# EAGLE schematic StripController1 (EAGLE 6.4)
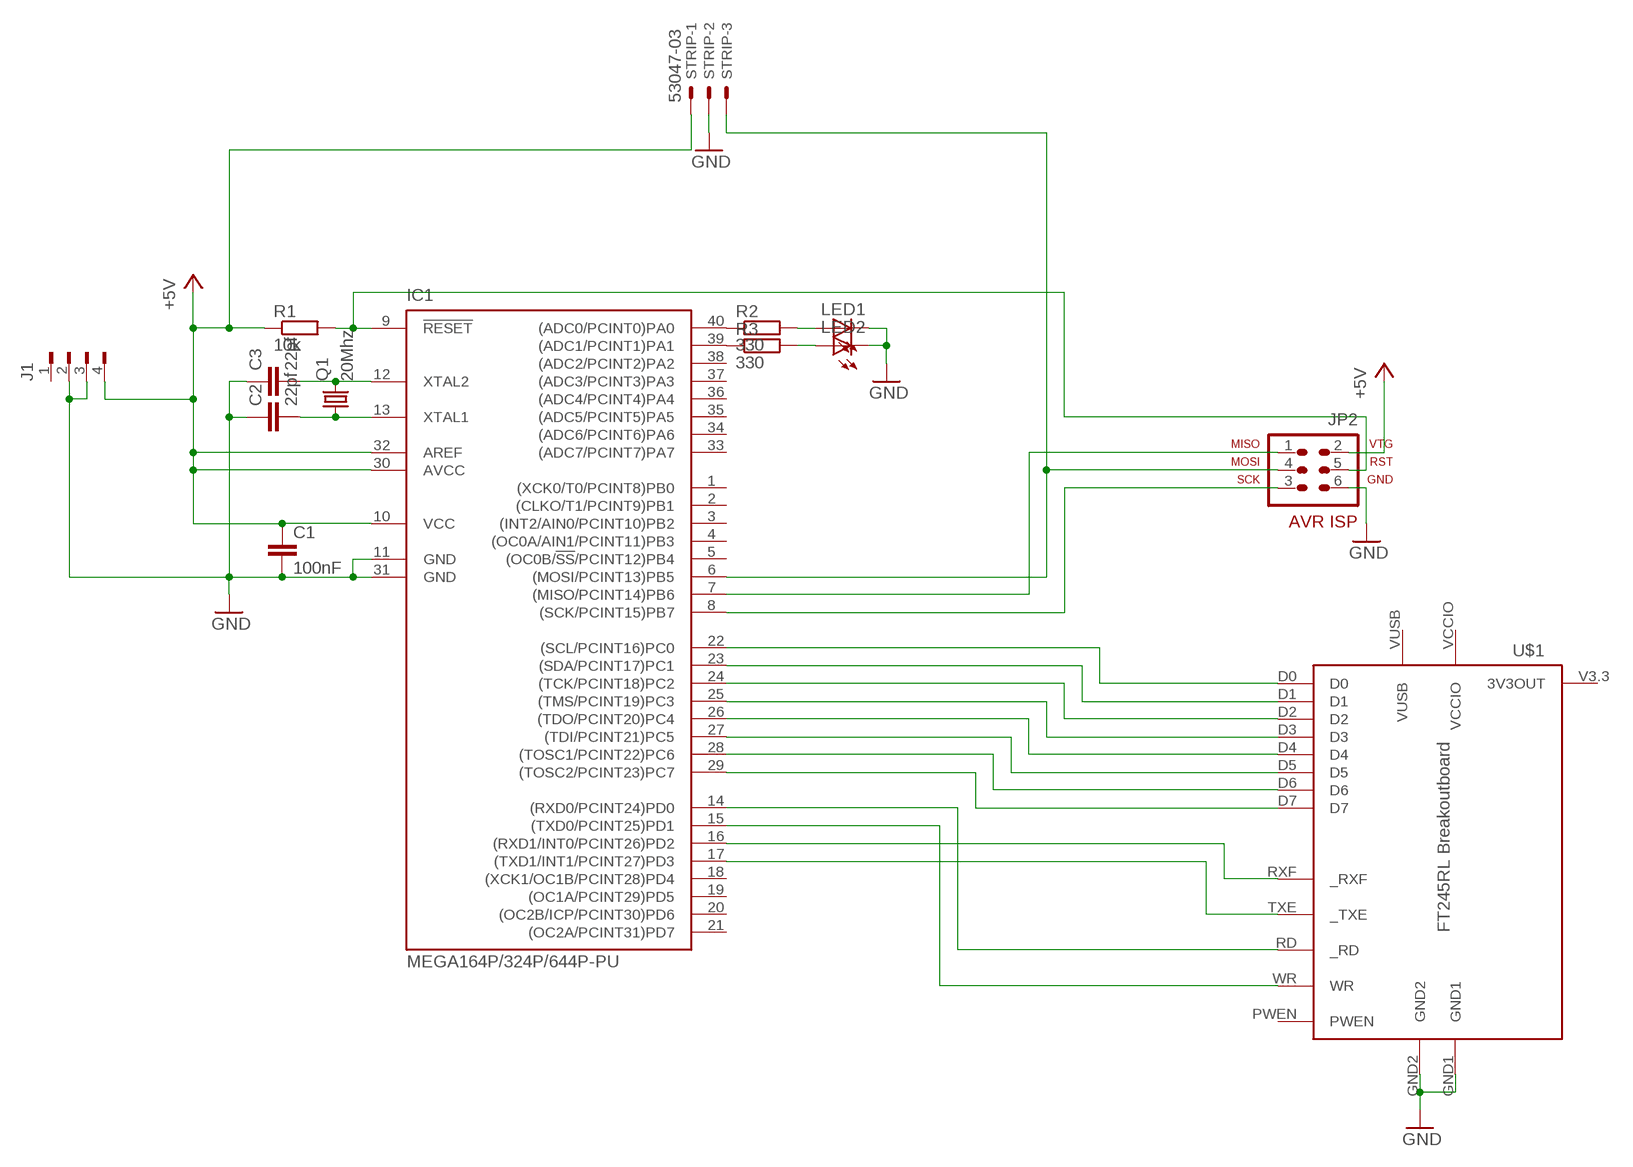
[diagram p0: schematic, sheet 1]

## Parts
C1  100nF  C-EU050-030X075  [C050-030X075]
C2  22pf  C-EU050-024X044  [C050-024X044]
C3  22pf  C-EU050-024X044  [C050-024X044]
IC1  MEGA164P/324P/644P-PU  [DIL40]
J1  FLOPPY-4  [FLOPPY-4]
JP2  AVR-ISP-6  [AVR-ISP-6]
LED1  LED3MM  [LED3MM]
LED2  LED3MM  [LED3MM]
Q1  20Mhz  CRYSTALHC49U70  [HC49U70]
R1  10k  R-EU_0207/10  [0207/10]
R2  330  R-EU_0207/10  [0207/10]
R3  330  R-EU_0207/10  [0207/10]
STRIP  53047-03  [53047-03]
U$1  FT245RL_BREAKOUTBOARD  [SPARKFUN_FT245RL_BOARD]

## Nets
+5V: C1.1 IC1.10(VCC) IC1.30(AVCC) IC1.32(AREF) J1.4 JP2.2 R1.1 STRIP.1
GND: C1.2 C2.1 C3.1 IC1.11(GND) IC1.31(GND) J1.2 J1.3 JP2.6 LED1.K(C) LED2.K(C) STRIP.2 U$1.GND1 U$1.GND2
N$1: IC1.8((SCK/PCINT15)PB7) JP2.3
N$2: IC1.7((MISO/PCINT14)PB6) JP2.1
N$3: IC1.40((ADC0/PCINT0)PA0) R2.1
N$4: IC1.9(!RESET) JP2.5 R1.2
N$5: IC1.6((MOSI/PCINT13)PB5) JP2.4 STRIP.3
N$6: IC1.39((ADC1/PCINT1)PA1) R3.1
N$7: IC1.22((SCL/PCINT16)PC0) U$1.D0
N$8: C2.2 IC1.13(XTAL1) Q1.1
N$9: C3.2 IC1.12(XTAL2) Q1.2
N$10: IC1.23((SDA/PCINT17)PC1) U$1.D1
N$11: IC1.24((TCK/PCINT18)PC2) U$1.D2
N$12: IC1.25((TMS/PCINT19)PC3) U$1.D3
N$13: IC1.26((TDO/PCINT20)PC4) U$1.D4
N$14: IC1.27((TDI/PCINT21)PC5) U$1.D5
N$15: IC1.28((TOSC1/PCINT22)PC6) U$1.D6
N$16: IC1.29((TOSC2/PCINT23)PC7) U$1.D7
N$17: IC1.17((TXD1/INT1/PCINT27)PD3) U$1.TXE(_TXE)
N$18: IC1.16((RXD1/INT0/PCINT26)PD2) U$1.RXF(_RXF)
N$19: IC1.14((RXD0/PCINT24)PD0) U$1.RD(_RD)
N$20: IC1.15((TXD0/PCINT25)PD1) U$1.WR
N$21: LED1.A R2.2
N$22: LED2.A R3.2
Unconnected: IC1.1((XCK0/T0/PCINT8)PB0) IC1.2((CLKO/T1/PCINT9)PB1) IC1.3((INT2/AIN0/PCINT10)PB2) IC1.4((OC0A/AIN1/PCINT11)PB3) IC1.5((OC0B/!SS!/PCINT12)PB4) IC1.18((XCK1/OC1B/PCINT28)PD4) IC1.19((OC1A/PCINT29)PD5) IC1.20((OC2B/ICP/PCINT30)PD6) IC1.21((OC2A/PCINT31)PD7) IC1.33((ADC7/PCINT7)PA7) IC1.34((ADC6/PCINT6)PA6) IC1.35((ADC5/PCINT5)PA5) IC1.36((ADC4/PCINT4)PA4) IC1.37((ADC3/PCINT3)PA3) IC1.38((ADC2/PCINT2)PA2) J1.1 U$1.PWEN U$1.V3.3(3V3OUT) U$1.VUSB

## Power pins joined to a net without a drawn wire
VCCIO: U$1.VCCIO

## Library data of the parts
C1-C3 = 0_Standard-Parts:C-EU: CAPACITOR, European symbol
IC1 = 0_avr:MEGA164P/324P/644P-PU
J1 = 0_con Tom:FLOPPY-4: MATE N-LOCK Floppy / HDD conector Distributor: Bürklin 71F970
JP2 = 0_avr:AVR-ISP-6: AVR ISP-6 Serial Programming Header
LED1 LED2 = 0_Led:LED: LED
Q1 = crystal:CRYSTAL: CRYSTAL
R1-R3 = 0_Standard-Parts:R-EU_: RESISTOR, European symbol
STRIP = con-molex:53?-03: CONNECTOR wire to board 1.25 mm (.049 inch) pitch header; MPN: 530470310; OC_FARNELL: 9732853; OC_NEWARK: 14R5412
U$1 = Sparkfun:FT245RL_BREAKOUTBOARD: Sparkfun FT245RL Breakoutboard